# Altium project PCB_Project_IMX7.PrjPCB (part 2 of 9)

## Sheet IMX7S_CPU_INTERFACES_1.SchDoc
size A2
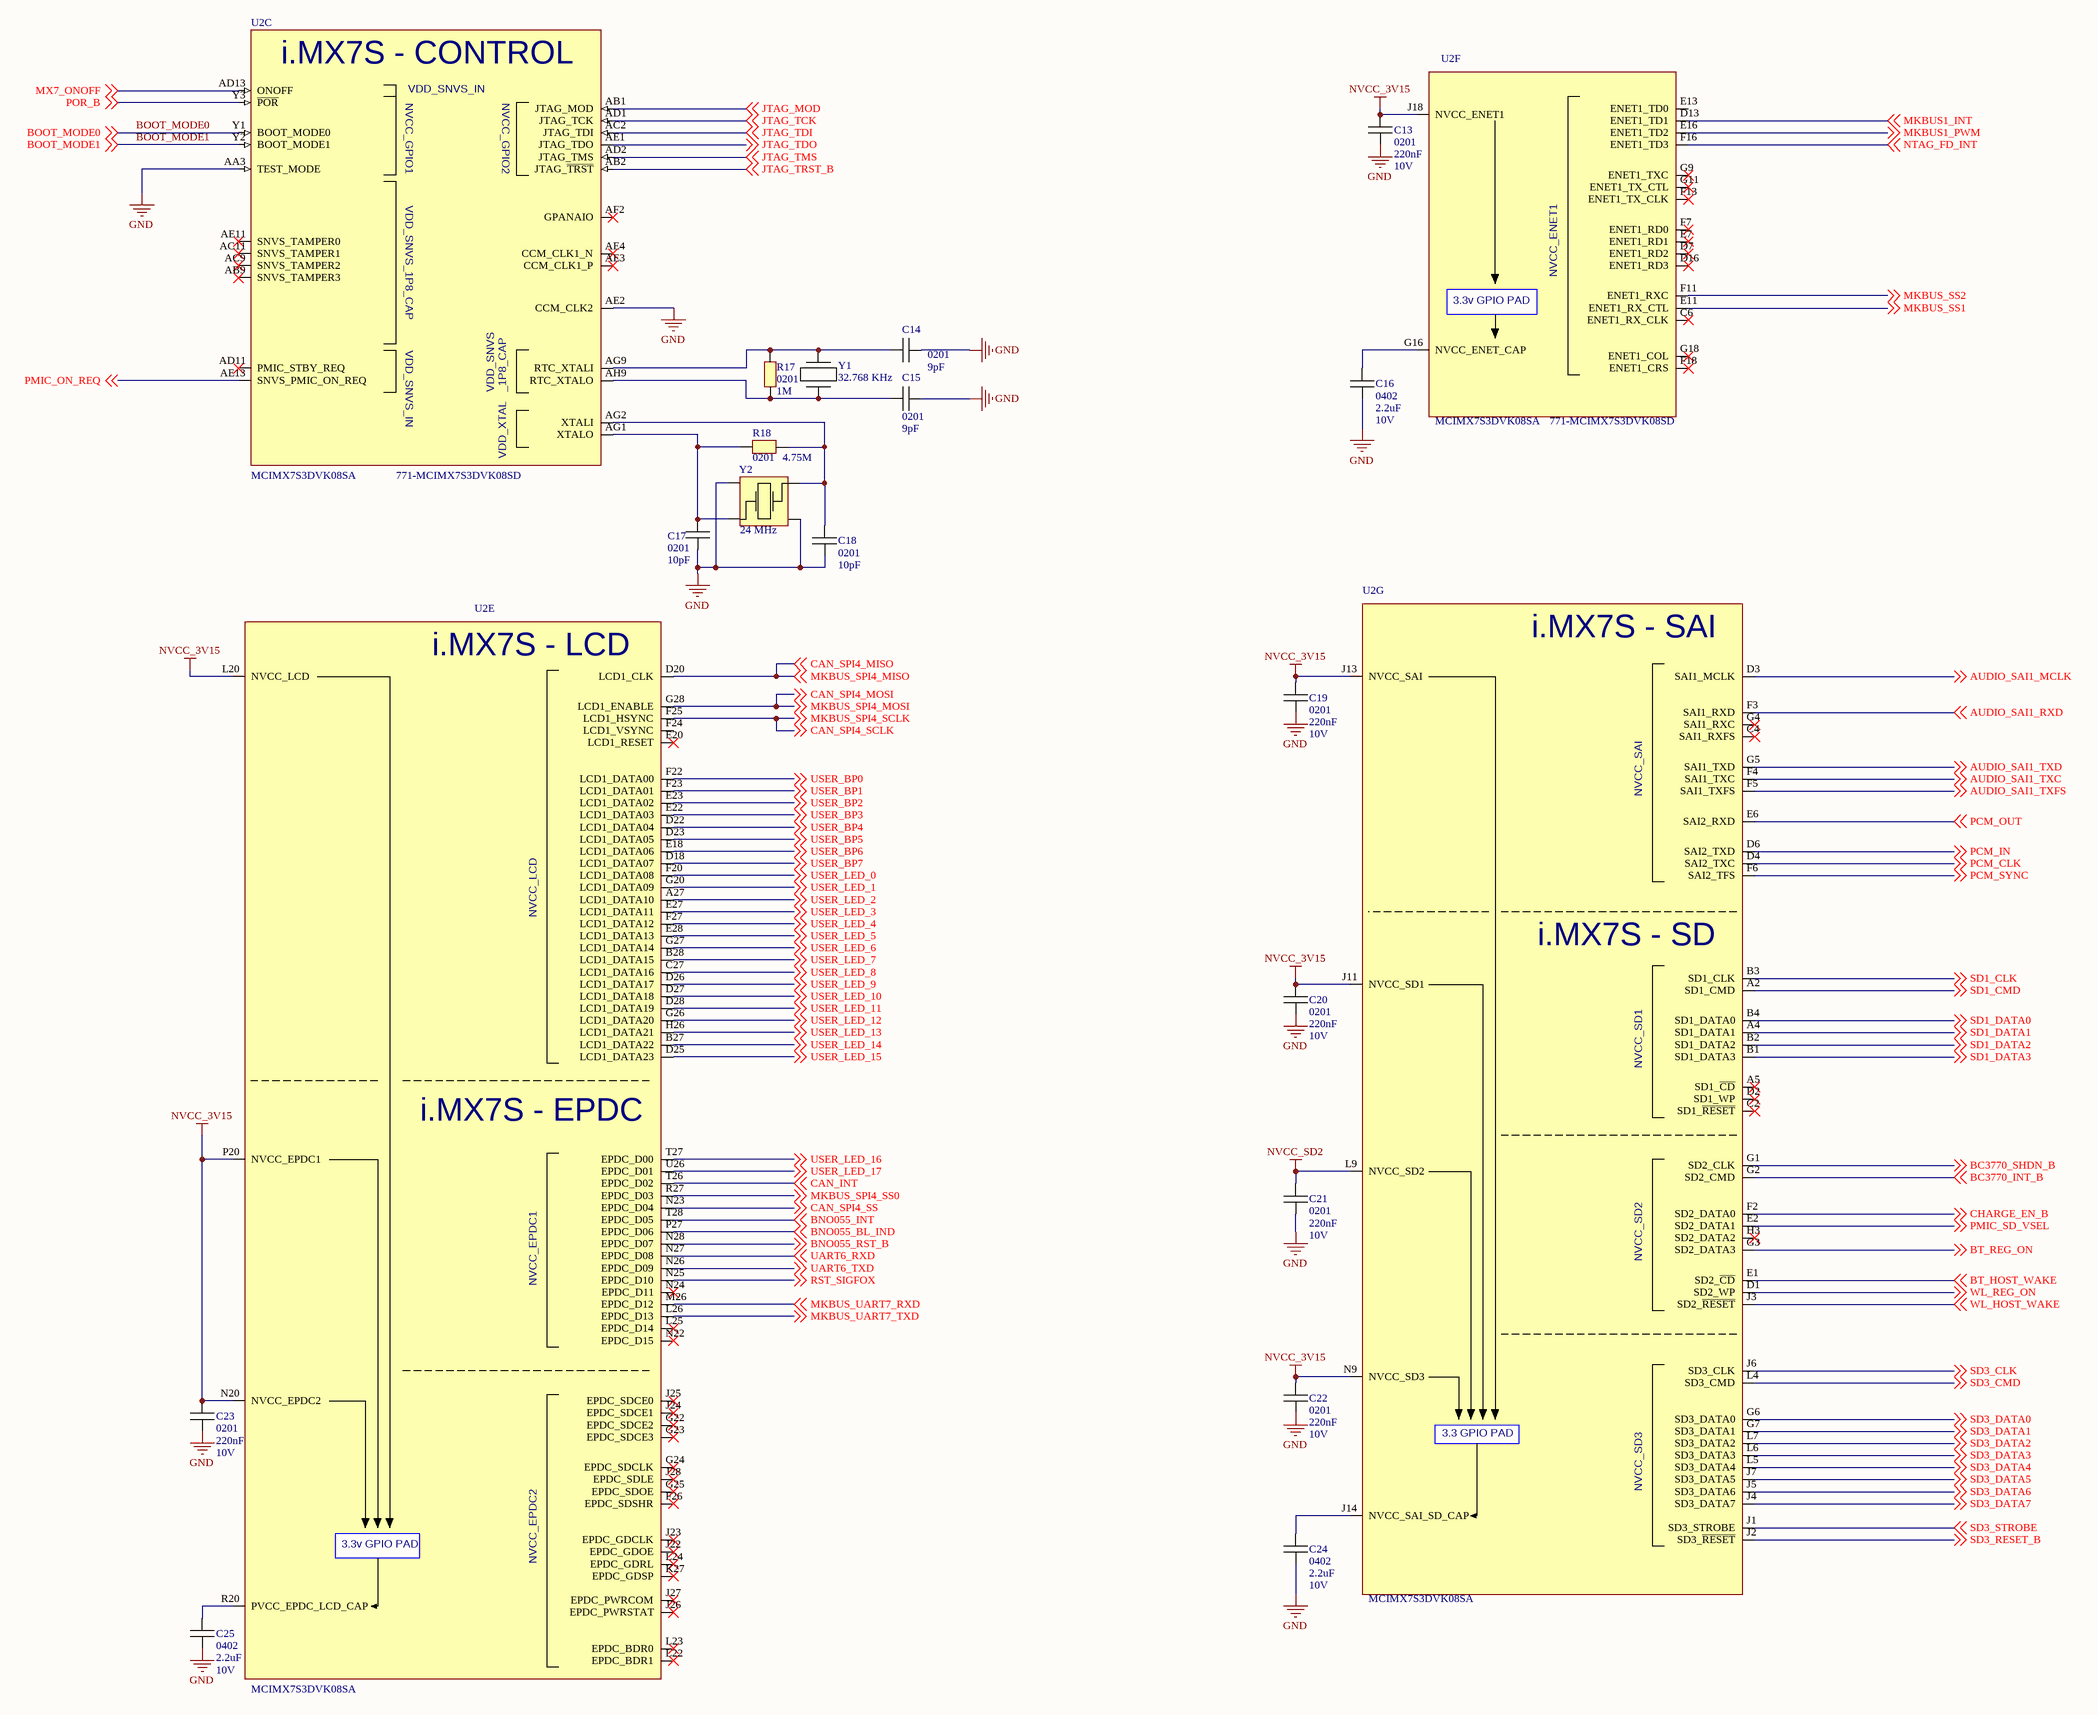
[diagram p2: IMX7S_CPU_INTERFACES_1.SchDoc]

### Parts
C13  value 220nF  PACKAGE: 0201  VOLTAGE: 10V  [C0201]  (hidden comment: C0201)
C14  value 9pF  PACKAGE: 0201  [C0201]  (hidden comment: C0201)
C15  value 9pF  PACKAGE: 0201  [C0201]  (hidden comment: C0201)
C16  value 2.2uF  PACKAGE: 0402  VOLTAGE: 10V  [C0402]  (hidden comment: C0402)
C17  value 10pF  PACKAGE: 0201  [C0201]  (hidden comment: C0201)
C18  value 10pF  PACKAGE: 0201  [C0201]  (hidden comment: C0201)
C19  value 220nF  PACKAGE: 0201  VOLTAGE: 10V  [C0201]  (hidden comment: C0201)
C20  value 220nF  PACKAGE: 0201  VOLTAGE: 10V  [C0201]  (hidden comment: C0201)
C21  value 220nF  PACKAGE: 0201  VOLTAGE: 10V  [C0201]  (hidden comment: C0201)
C22  value 220nF  PACKAGE: 0201  VOLTAGE: 10V  [C0201]  (hidden comment: C0201)
C23  value 220nF  PACKAGE: 0201  VOLTAGE: 10V  [C0201]  (hidden comment: C0201)
C24  value 2.2uF  PACKAGE: 0402  VOLTAGE: 10V  [C0402]  (hidden comment: C0402)
C25  value 2.2uF  PACKAGE: 0402  VOLTAGE: 10V  [C0402]  (hidden comment: C0402)
R17  value 1M  PACKAGE: 0201  [R0201]  (hidden comment: R0201)
R18  value 4.75M  PACKAGE: 0201  [R0201]  (hidden comment: R0201)
U2  MCIMX7S3DVK08SA  Supplier Part Number 1: 771-MCIMX7S3DVK08SD  [BGA 488 PIN]  (parts C,E,F,G of 13)
Y1  32.768 KHz  [ABS07]
Y2  24 MHz  [3225 Crystal]

### Nets
GND: C13.1 C14.1 C15.1 C16.1 C17.1 C18.1 C19.1 C20.1 C21.1 C22.1 C23.1 C24.1 C25.1 U2.AA3(TEST_MODE) U2.AE2(CCM_CLK2) Y2.1 Y2.3
NVCC_3V15: C13.2 C19.2 C20.2 C22.2 C23.2 U2.J11(NVCC_SD1) U2.J13(NVCC_SAI) U2.J18(NVCC_ENET1) U2.L20(NVCC_LCD) U2.N9(NVCC_SD3) U2.N20(NVCC_EPDC2) U2.P20(NVCC_EPDC1)
NVCC_SD2: C21.2 U2.L9(NVCC_SD2)
AUDIO_SAI1_MCLK: U2.D3(SAI1_MCLK) ; off-sheet AUDIO_SAI1_MCLK
AUDIO_SAI1_RXD: U2.F3(SAI1_RXD) ; off-sheet AUDIO_SAI1_RXD
AUDIO_SAI1_TXC: U2.F4(SAI1_TXC) ; off-sheet AUDIO_SAI1_TXC
AUDIO_SAI1_TXD: U2.G5(SAI1_TXD) ; off-sheet AUDIO_SAI1_TXD
AUDIO_SAI1_TXFS: U2.F5(SAI1_TXFS) ; off-sheet AUDIO_SAI1_TXFS
BC3770_INT_B: U2.G2(SD2_CMD) ; off-sheet BC3770_INT_B
BC3770_SHDN_B: U2.G1(SD2_CLK) ; off-sheet BC3770_SHDN_B
BNO055_BL_IND: U2.P27(EPDC_D06) ; off-sheet BNO055_BL_IND
BNO055_INT: U2.T28(EPDC_D05) ; off-sheet BNO055_INT
BNO055_RST_B: U2.N28(EPDC_D07) ; off-sheet BNO055_RST_B
BOOT_MODE0: U2.Y1(BOOT_MODE0) ; off-sheet BOOT_MODE0
BOOT_MODE1: U2.Y2(BOOT_MODE1) ; off-sheet BOOT_MODE1
BT_HOST_WAKE: U2.E1(SD2_~{CD}) ; off-sheet BT_HOST_WAKE
BT_REG_ON: U2.G3(SD2_DATA3) ; off-sheet BT_REG_ON
CAN_INT: U2.T26(EPDC_D02) ; off-sheet CAN_INT
CAN_SPI4_MISO: U2.D20(LCD1_CLK) ; off-sheet MKBUS_SPI4_MISO, off-sheet CAN_SPI4_MISO  [also labelled MKBUS_SPI4_MISO]
CAN_SPI4_MOSI: U2.G28(LCD1_ENABLE) ; off-sheet MKBUS_SPI4_MOSI, off-sheet CAN_SPI4_MOSI  [also labelled MKBUS_SPI4_MOSI]
CAN_SPI4_SCLK: U2.F25(LCD1_HSYNC) ; off-sheet MKBUS_SPI4_SCLK, off-sheet CAN_SPI4_SCLK  [also labelled MKBUS_SPI4_SCLK]
CAN_SPI4_SS: U2.N23(EPDC_D04) ; off-sheet CAN_SPI4_SS
CHARGE_EN_B: U2.F2(SD2_DATA0) ; off-sheet CHARGE_EN_B
JTAG_MOD: U2.AB1(JTAG_MOD) ; off-sheet JTAG_MOD
JTAG_TCK: U2.AD1(JTAG_TCK) ; off-sheet JTAG_TCK
JTAG_TDI: U2.AC2(JTAG_TDI) ; off-sheet JTAG_TDI
JTAG_TDO: U2.AE1(JTAG_TDO) ; off-sheet JTAG_TDO
JTAG_TMS: U2.AD2(JTAG_TMS) ; off-sheet JTAG_TMS
JTAG_TRST_B: U2.AB2(JTAG_~{TRST}) ; off-sheet JTAG_TRST_B
MKBUS1_INT: U2.D13(ENET1_TD1) ; off-sheet MKBUS1_INT
MKBUS1_PWM: U2.E16(ENET1_TD2) ; off-sheet MKBUS1_PWM
MKBUS_SPI4_SS0: U2.R27(EPDC_D03) ; off-sheet MKBUS_SPI4_SS0
MKBUS_SS1: U2.E11(ENET1_RX_CTL) ; off-sheet MKBUS_SS1
MKBUS_SS2: U2.F11(ENET1_RXC) ; off-sheet MKBUS_SS2
MKBUS_UART7_RXD: U2.M26(EPDC_D12) ; off-sheet MKBUS_UART7_RXD
MKBUS_UART7_TXD: U2.L26(EPDC_D13) ; off-sheet MKBUS_UART7_TXD
MX7_ONOFF: U2.AD13(ONOFF) ; off-sheet MX7_ONOFF
NTAG_FD_INT: U2.F16(ENET1_TD3) ; off-sheet NTAG_FD_INT
PCM_CLK: U2.D4(SAI2_TXC) ; off-sheet PCM_CLK
PCM_IN: U2.D6(SAI2_TXD) ; off-sheet PCM_IN
PCM_OUT: U2.E6(SAI2_RXD) ; off-sheet PCM_OUT
PCM_SYNC: U2.F6(SAI2_TFS) ; off-sheet PCM_SYNC
PMIC_ON_REQ: U2.AE13(SNVS_PMIC_ON_REQ) ; off-sheet PMIC_ON_REQ
PMIC_SD_VSEL: U2.E2(SD2_DATA1) ; off-sheet PMIC_SD_VSEL
POR_B: U2.Y3(~{POR}) ; off-sheet POR_B
RST_SIGFOX: U2.N25(EPDC_D10) ; off-sheet RST_SIGFOX
SD1_CLK: U2.B3(SD1_CLK) ; off-sheet SD1_CLK
SD1_CMD: U2.A2(SD1_CMD) ; off-sheet SD1_CMD
SD1_DATA0: U2.B4(SD1_DATA0) ; off-sheet SD1_DATA0
SD1_DATA1: U2.A4(SD1_DATA1) ; off-sheet SD1_DATA1
SD1_DATA2: U2.B2(SD1_DATA2) ; off-sheet SD1_DATA2
SD1_DATA3: U2.B1(SD1_DATA3) ; off-sheet SD1_DATA3
SD3_CLK: U2.J6(SD3_CLK) ; off-sheet SD3_CLK
SD3_CMD: U2.L4(SD3_CMD) ; off-sheet SD3_CMD
SD3_DATA0: U2.G6(SD3_DATA0) ; off-sheet SD3_DATA0
SD3_DATA1: U2.G7(SD3_DATA1) ; off-sheet SD3_DATA1
SD3_DATA2: U2.L7(SD3_DATA2) ; off-sheet SD3_DATA2
SD3_DATA3: U2.L6(SD3_DATA3) ; off-sheet SD3_DATA3
SD3_DATA4: U2.L5(SD3_DATA4) ; off-sheet SD3_DATA4
SD3_DATA5: U2.J7(SD3_DATA5) ; off-sheet SD3_DATA5
SD3_DATA6: U2.J5(SD3_DATA6) ; off-sheet SD3_DATA6
SD3_DATA7: U2.J4(SD3_DATA7) ; off-sheet SD3_DATA7
SD3_RESET_B: U2.J2(SD3_~{RESET}) ; off-sheet SD3_RESET_B
SD3_STROBE: U2.J1(SD3_STROBE) ; off-sheet SD3_STROBE
UART6_RXD: U2.N27(EPDC_D08) ; off-sheet UART6_RXD
UART6_TXD: U2.N26(EPDC_D09) ; off-sheet UART6_TXD
USER_BP0: U2.F22(LCD1_DATA00) ; off-sheet USER_BP0
USER_BP1: U2.F23(LCD1_DATA01) ; off-sheet USER_BP1
USER_BP2: U2.E23(LCD1_DATA02) ; off-sheet USER_BP2
USER_BP3: U2.E22(LCD1_DATA03) ; off-sheet USER_BP3
USER_BP4: U2.D22(LCD1_DATA04) ; off-sheet USER_BP4
USER_BP5: U2.D23(LCD1_DATA05) ; off-sheet USER_BP5
USER_BP6: U2.E18(LCD1_DATA06) ; off-sheet USER_BP6
USER_BP7: U2.D18(LCD1_DATA07) ; off-sheet USER_BP7
USER_LED_0: U2.F20(LCD1_DATA08) ; off-sheet USER_LED_0
USER_LED_1: U2.G20(LCD1_DATA09) ; off-sheet USER_LED_1
USER_LED_2: U2.A27(LCD1_DATA10) ; off-sheet USER_LED_2
USER_LED_3: U2.E27(LCD1_DATA11) ; off-sheet USER_LED_3
USER_LED_4: U2.F27(LCD1_DATA12) ; off-sheet USER_LED_4
USER_LED_5: U2.E28(LCD1_DATA13) ; off-sheet USER_LED_5
USER_LED_6: U2.G27(LCD1_DATA14) ; off-sheet USER_LED_6
USER_LED_7: U2.B28(LCD1_DATA15) ; off-sheet USER_LED_7
USER_LED_8: U2.C27(LCD1_DATA16) ; off-sheet USER_LED_8
USER_LED_9: U2.D26(LCD1_DATA17) ; off-sheet USER_LED_9
USER_LED_10: U2.D27(LCD1_DATA18) ; off-sheet USER_LED_10
USER_LED_11: U2.D28(LCD1_DATA19) ; off-sheet USER_LED_11
USER_LED_12: U2.G26(LCD1_DATA20) ; off-sheet USER_LED_12
USER_LED_13: U2.H26(LCD1_DATA21) ; off-sheet USER_LED_13
USER_LED_14: U2.B27(LCD1_DATA22) ; off-sheet USER_LED_14
USER_LED_15: U2.D25(LCD1_DATA23) ; off-sheet USER_LED_15
USER_LED_16: U2.T27(EPDC_D00) ; off-sheet USER_LED_16
USER_LED_17: U2.U26(EPDC_D01) ; off-sheet USER_LED_17
WL_HOST_WAKE: U2.J3(SD2_~{RESET}) ; off-sheet WL_HOST_WAKE
WL_REG_ON: U2.D1(SD2_WP) ; off-sheet WL_REG_ON
NetC14_2: C14.2 R17.2 U2.AG9(RTC_XTALI) Y1.2
NetC15_2: C15.2 R17.1 U2.AH9(RTC_XTALO) Y1.1
NetC16_2: C16.2 U2.G16(NVCC_ENET_CAP)
NetC17_2: C17.2 R18.2 U2.AG1(XTALO) Y2.2
NetC18_2: C18.2 R18.1 U2.AG2(XTALI) Y2.4
NetC24_2: C24.2 U2.J14(NVCC_SAI_SD_CAP)
NetC25_2: C25.2 U2.R20(PVCC_EPDC_LCD_CAP)

Not connected (* = marked no-connect by the designer): U2 A5(SD1_~{CD})* AB9(SNVS_TAMPER3)* AC9(SNVS_TAMPER2)* AC11(SNVS_TAMPER1)* AD11(PMIC_STBY_REQ)* AE3(CCM_CLK1_P)* AE4(CCM_CLK1_N)* AE11(SNVS_TAMPER0)* AF2(GPANAIO)* C2(SD1_~{RESET})* C4(SAI1_RXFS)* C6(ENET1_RX_CLK)* D2(SD1_WP)* D7(ENET1_RD2)* D16(ENET1_RD3)* E7(ENET1_RD1)* E13(ENET1_TD0) E20(LCD1_RESET)* F7(ENET1_RD0)* F13(ENET1_TX_CLK)* F18(ENET1_CRS)* F24(LCD1_VSYNC) F26(EPDC_SDSHR)* G4(SAI1_RXC)* G9(ENET1_TXC)* G11(ENET1_TX_CTL)* G18(ENET1_COL)* G22(EPDC_SDCE2)* G23(EPDC_SDCE3)* G24(EPDC_SDCLK)* G25(EPDC_SDOE)* H3(SD2_DATA2)* J22(EPDC_GDOE)* J23(EPDC_GDCLK)* J24(EPDC_SDCE1)* J25(EPDC_SDCE0)* J26(EPDC_PWRSTAT)* J27(EPDC_PWRCOM)* J28(EPDC_SDLE)* K27(EPDC_GDSP)* L22(EPDC_BDR1)* L23(EPDC_BDR0)* L24(EPDC_GDRL)* L25(EPDC_D14)* N22(EPDC_D15)* N24(EPDC_D11)*

### Notes on the sheet
- Title
- Size:
- Date:
- File:
- A2
- Number:
- Time:
- Revision:
- Sheet
- of
- (in symbol MCIMX7S3DVK08SD, part C) i.MX7S - CONTROL; VDD_SNVS; _1P8_CAP; VDD_XTAL
- (in symbol MCIMX7S3DVK08SD, part E) i.MX7S - LCD; i.MX7S - EPDC; 3.3v GPIO PAD
- (in symbol MCIMX7S3DVK08SD, part F) 3.3v GPIO PAD
- (in symbol MCIMX7S3DVK08SD, part G) i.MX7S - SAI; i.MX7S - SD; 3.3 GPIO PAD

### Library data of the parts
C13 C19-C23 = C0201: as C114 on sheet IMX7S_PMIC; Supplier 1: Farnell; Supplier Part Number 1: 2990687; Stock 1: 4290; Pricing 1: 10=0,04270, 100=0,02370, 500=0,01800, 2500=0,01350, 7500=0,00950, 15000=0,00760, 75000=0,00630 (EUR); RoHS: Yes; Mount: Surface Mount; Case/Package: 0201; Case Code (Metric): 0603; Case Code (Imperial): 0201; Min Operating Temperature: -55°C; Max Operating Temperature: 85°C; Capacitance: 220nF; Voltage Rating (DC): 10V; Packaging: Tape and Reel; Voltage Rating: 10V; Length: 0.024inch; Width: 0.012inch; Thickness: 0.013inch; ComponentLink1URL: http://www.mouser.com/ds/2/281/c02e-2905.pdf?src-supplier=Mouser; ComponentLink1Description: http://www.mouser.com/ds/2/281/c02e-2905.pdf?src-supplier=Mouser; ComponentLink2URL: http://search.murata.co.jp/Ceramy/image/img/A01X/G101/ENG/GRM033R61A224KE90-01.pdf?src-supplier=Digi-Key; ComponentLink2Description: http://search.murata.co.jp/Ceramy/image/img/A01X/G101/ENG/GRM033R61A224KE90-01.pdf?src-supplier=Digi-Key
C14 C15 = C0201: Manufacturer 1: TDK; Manufacturer Part Number 1: CGA1A2C0G1E090D030BA; VOLTAGE: 0V; Description: CAP CER 9PF 25V C0G 0201; Voltage Rating: 25V; Dielectric: C0G; Supplier 1: RSComponents; Supplier Part Number 1: 1447034; Stock 1: 15000; Pricing 1: 15000=0,00900 (EUR); RoHS: Yes; Mount: Surface Mount; Case/Package: 0201; Weight: 6E-06oz; Case Code (Metric): 0603; Case Code (Imperial): 0201; Min Operating Temperature: -55°C; Max Operating Temperature: 125°C; Package Quantity: 1; Packaging: Tape and Reel; Capacitance: 9pF; Voltage Rating (DC): 25V; Termination: SMD/SMT; Composition: Ceramic; Length: 0.024inch; Height: 0.3mm; Width: 0.012inch; Thickness: 0.012inch; Ratings: AEC-Q200; ComponentLink1URL: http://www.mouser.com/ds/2/400/lcc_automotive_general_en-843974.pdf?src-supplier=Mouser; ComponentLink1Description: http://www.mouser.com/ds/2/400/lcc_automotive_general_en-843974.pdf?src-supplier=Mouser; ComponentLink2URL: https://product.tdk.com/info/en/documents/chara_sheet/CGA1A2C0G1E090D030BA.pdf?src-supplier=Digi-Key; ComponentLink2Description: https://product.tdk.com/info/en/documents/chara_sheet/CGA1A2C0G1E090D030BA.pdf?src-supplier=Digi-Key; ComponentLink3URL: https://product.tdk.com/info/en/catalog/datasheets/mlcc_automotive_general_en.pdf?src-supplier=Digi-Key; ComponentLink3Description: https://product.tdk.com/info/en/catalog/datasheets/mlcc_automotive_general_en.pdf?src-supplier=Digi-Key; ComponentLink4URL: http://product.tdk.com/capacitor/mlcc/en/documents/mlcc_automotive_general_en.pdf?src-supplier=Avnet; ComponentLink4Description: http://product.tdk.com/capacitor/mlcc/en/documents/mlcc_automotive_general_en.pdf?src-supplier=Avnet
C16 C24 C25 = C0402: as C109 on sheet IMX7S_PMIC; Supplier 1: Farnell; Supplier Part Number 1: 2533930; Stock 1: 11802; Pricing 1: 10=0,21600, 100=0,14100, 500=0,10600, 2500=0,09320, 5000=0,07880, 10000=0,07420, 50000=0,06950 (EUR); RoHS: Yes; Mount: Surface Mount; Case/Package: 0402; Case Code (Metric): 1005; Case Code (Imperial): 0402; Min Operating Temperature: -55°C; Max Operating Temperature: 85°C; Packaging: Tape and Reel; Capacitance: 2.2uF; Voltage Rating: 10V; Length: 0.039inch; Width: 0.02inch; Thickness: 0.022inch; ComponentLink1URL: http://www.farnell.com/datasheets/2031748.pdf?src-supplier=Farnell; ComponentLink1Description: http://www.farnell.com/datasheets/2031748.pdf?src-supplier=Farnell; ComponentLink2URL: https://katalog.we-online.de/pbs/datasheet/885012105013.pdf?src-supplier=Digi-Key; ComponentLink2Description: https://katalog.we-online.de/pbs/datasheet/885012105013.pdf?src-supplier=Digi-Key
C17 C18 = C0201: Manufacturer 1: Murata; Manufacturer Part Number 1: GRM0335C1H180GA01D; VOLTAGE: 0V; Description: 0201 18 pF 50 V ±2% Tolerance C0G/NP0 Multilayer Ceramic Capacitor; Voltage Rating: 50V; Capacitance: 18pF; Tolerance: 2%; Supplier 1: Farnell; Supplier Part Number 1: 2990623; Stock 1: 11590; Pricing 1: 10=0,02610, 100=0,01320, 500=0,00970, 2500=0,00770, 7500=0,00570, 15000=0,00460, 75000=0,00310 (EUR); RoHS: Yes; Mount: Surface Mount; Case/Package: 0201; Case Code (Metric): 0603; Case Code (Imperial): 0201; Min Operating Temperature: -55°C; Max Operating Temperature: 125°C; Package Quantity: 15000; Packaging: Tape and Reel; Termination: SMD/SMT; Voltage Rating (DC): 50V; Length: 0.024inch; Width: 0.012inch; Thickness: 0.013inch; ComponentLink1URL: http://www.mouser.com/ds/2/281/c02e-2905.pdf?src-supplier=Mouser; ComponentLink1Description: http://www.mouser.com/ds/2/281/c02e-2905.pdf?src-supplier=Mouser; ComponentLink2URL: http://search.murata.co.jp/Ceramy/image/img/A01X/partnumbering_e_01.pdf?src-supplier=Digi-Key; ComponentLink2Description: http://search.murata.co.jp/Ceramy/image/img/A01X/partnumbering_e_01.pdf?src-supplier=Digi-Key; ComponentLink3URL: http://search.murata.co.jp/Ceramy/image/img/A01X/G101/ENG/GRM0335C1H180GA01-01.pdf?src-supplier=Digi-Key; ComponentLink3Description: http://search.murata.co.jp/Ceramy/image/img/A01X/G101/ENG/GRM0335C1H180GA01-01.pdf?src-supplier=Digi-Key
R17 = R0201: Manufacturer 1: Multicomp; Manufacturer Part Number 1: MCRE000212; VOLTAGE: 0V; Description: MULTICOMP   MCRE000212   Surface Mount Chip Resistor, Thick Film, MCRE Series, 1 Mohm, 50 mW,  1%, 25 V, 0201 [0603 Metric]; Resistance: 1MR; Power Rating: 50mW; Tolerance: 1%; Voltage Rating: 25V; Temperature Coefficient: 200ppm/°C; Supplier 1: Farnell; Supplier Part Number 1: 1711695; Stock 1: 21808; Pricing 1: 10=0,01700, 100=0,01020, 500=0,00730, 2500=0,00570, 7500=0,00460 (EUR); RoHS: Yes; Case/Package: SMD/SMT; Case Code (Metric): 0603; Case Code (Imperial): 0201; Min Operating Temperature: -55°C; Max Operating Temperature: 125°C; Packaging: Cut Tape; Composition: Thick Film; Voltage Rating (DC): 25V; Width: 0.6mm; REACH SVHC: No SVHC; ComponentLink1URL: https://datasheet.ciiva.com/7919/1729044-7919021.pdf?src-supplier=Element14; ComponentLink1Description: https://datasheet.ciiva.com/7919/1729044-7919021.pdf?src-supplier=Element14; ComponentLink2URL: https://datasheet.ciiva.com/7919/1729044-7919022.pdf?src-supplier=Element14; ComponentLink2Description: https://datasheet.ciiva.com/7919/1729044-7919022.pdf?src-supplier=Element14; ComponentLink3URL: https://datasheet.ciiva.com/22689/1729044-22689531.pdf?src-supplier=Element14; ComponentLink3Description: https://datasheet.ciiva.com/22689/1729044-22689531.pdf?src-supplier=Element14
R18 = R0201: Manufacturer 1: Multicomp; Manufacturer Part Number 1: MC0201L6J4704SE; VOLTAGE: 0V; Description: MULTICOMP - MC0201L6J4704SE - RES, 4M7, 5%, 0.05W, 0201, THICK FILM; Resistance: 4.7MR; Tolerance: 5%; Temperature Coefficient: 200ppm/°C; Power Rating: 50mW; Voltage Rating: 25V; Supplier 1: Farnell; Supplier Part Number 1: 1851499; Stock 1: 16622; Pricing 1: 10=0,00930, 100=0,00720, 500=0,00640, 2500=0,00440, 5000=0,00380, 10000=0,00330, 50000=0,00240, 100000=0,00230 (EUR); RoHS: Yes; Case/Package: 0201; Number of Pins: 2; Case Code (Metric): 0603; Case Code (Imperial): 0201; Packaging: Cut Tape; Composition: Thick Film; Voltage Rating (DC): 25V; REACH SVHC: Unknown; ComponentLink1URL: http://www.farnell.com/datasheets/1719193.pdf?src-supplier=Farnell; ComponentLink1Description: http://www.farnell.com/datasheets/1719193.pdf?src-supplier=Farnell; ComponentLink2URL: http://www.farnell.com/datasheets/1719193.pdf?src-supplier=Element14; ComponentLink2Description: http://www.farnell.com/datasheets/1719193.pdf?src-supplier=Element14
U2 = MCIMX7S3DVK08SD: Supplier 1: Mouser
Y1 = Quartz 32.768: Supplier 1: Farnell; Supplier Part Number 1: 2819305
Y2 = Quartz 24M: Supplier 1: Farnell; Supplier Part Number 1: 2853961

## Sheet IMX7S_CPU_INTERFACES_2.SchDoc
size A2
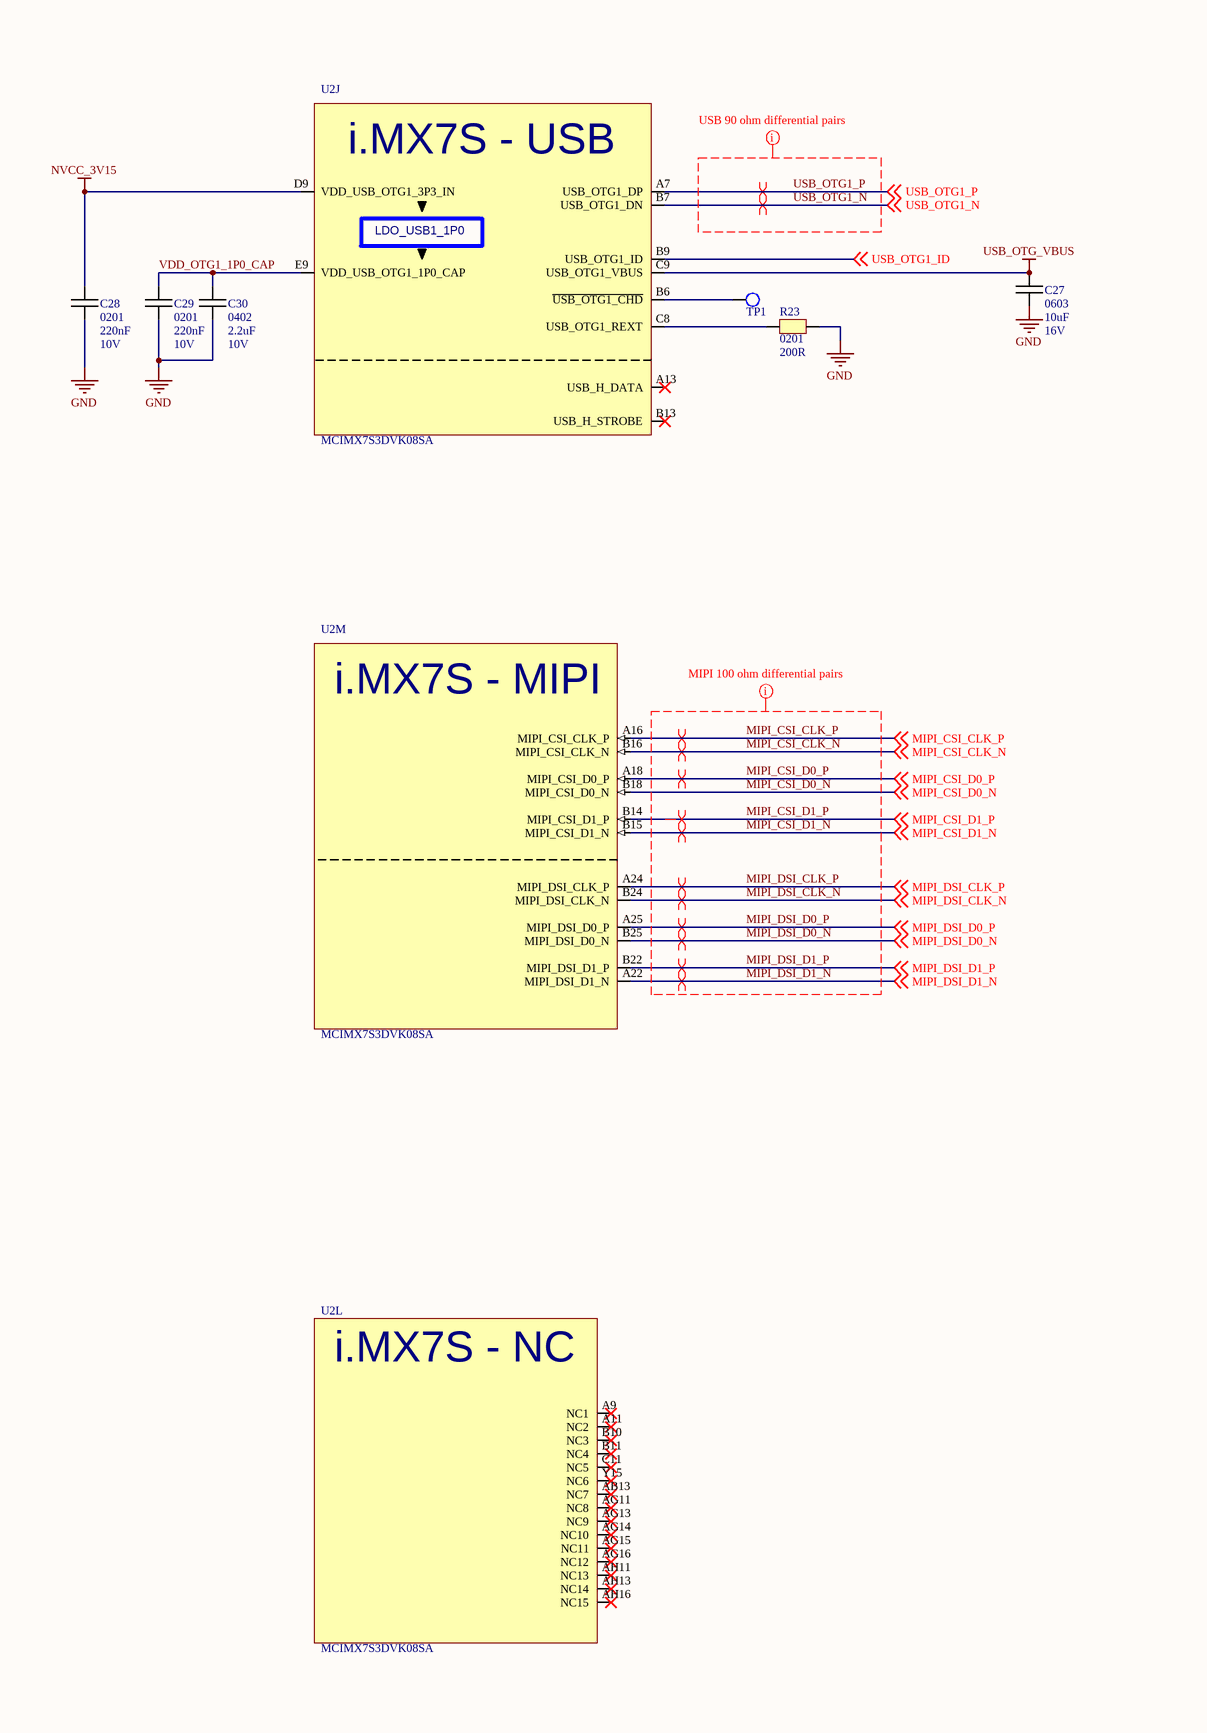
[diagram p3: IMX7S_CPU_INTERFACES_2.SchDoc, left]
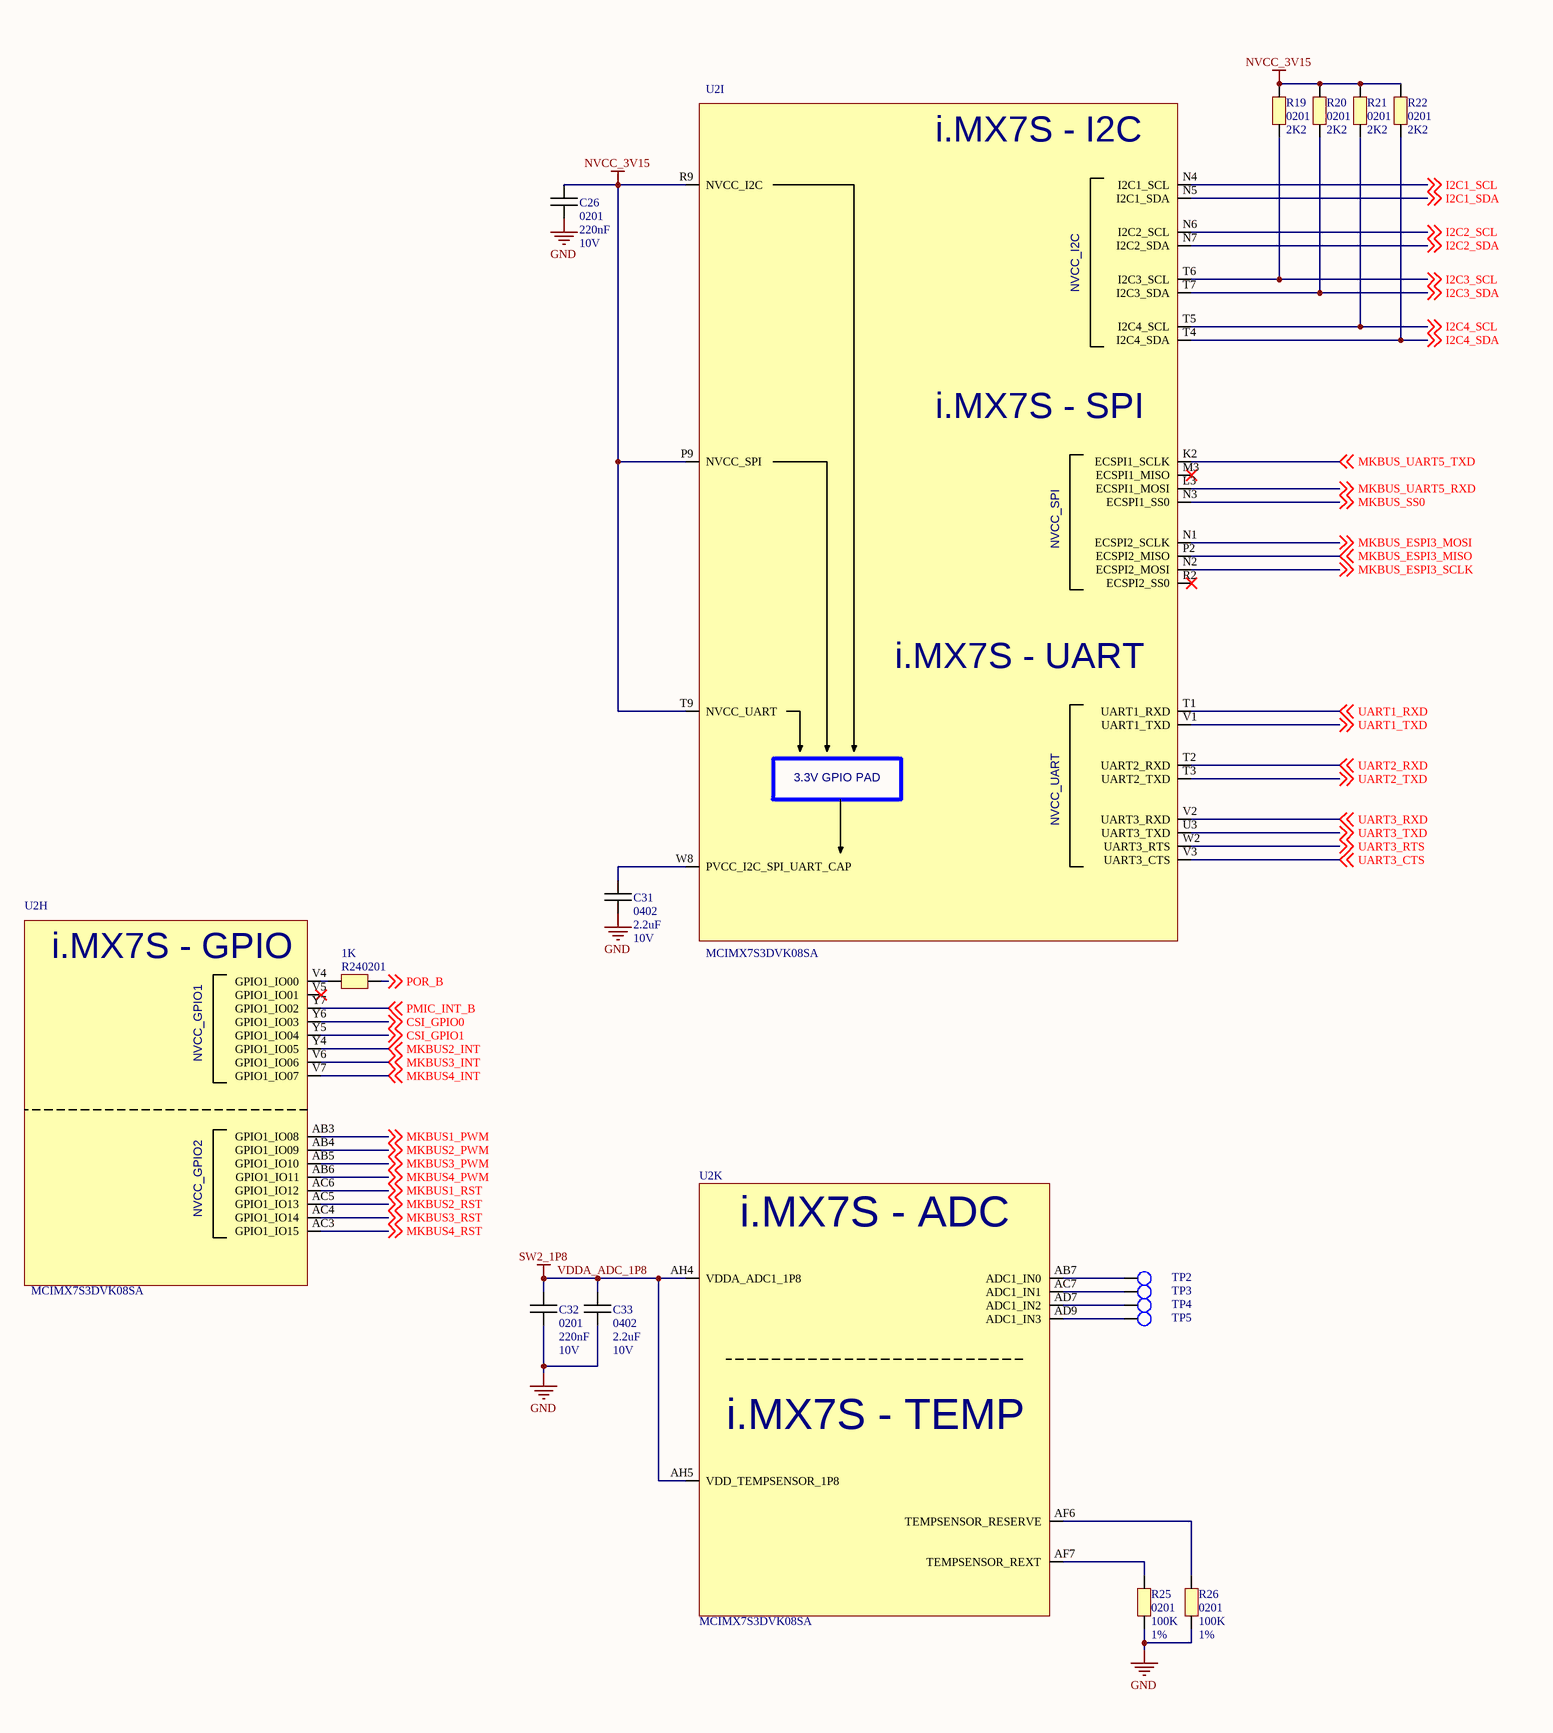
[diagram p4: IMX7S_CPU_INTERFACES_2.SchDoc, right]

### Parts
C26  value 220nF  PACKAGE: 0201  VOLTAGE: 10V  [C0201]  (hidden comment: C0201)
C27  value 10uF  PACKAGE: 0603  VOLTAGE: 16V  [C0603]  (hidden comment: C0603)
C28  value 220nF  PACKAGE: 0201  VOLTAGE: 10V  [C0201]  (hidden comment: C0201)
C29  value 220nF  PACKAGE: 0201  VOLTAGE: 10V  [C0201]  (hidden comment: C0201)
C30  value 2.2uF  PACKAGE: 0402  VOLTAGE: 10V  [C0402]  (hidden comment: C0402)
C31  value 2.2uF  PACKAGE: 0402  VOLTAGE: 10V  [C0402]  (hidden comment: C0402)
C32  value 220nF  PACKAGE: 0201  VOLTAGE: 10V  [C0201]  (hidden comment: C0201)
C33  value 2.2uF  PACKAGE: 0402  VOLTAGE: 10V  [C0402]  (hidden comment: C0402)
R19  value 2K2  PACKAGE: 0201  [R0201]  (hidden comment: R0201)
R20  value 2K2  PACKAGE: 0201  [R0201]  (hidden comment: R0201)
R21  value 2K2  PACKAGE: 0201  [R0201]  (hidden comment: R0201)
R22  value 2K2  PACKAGE: 0201  [R0201]  (hidden comment: R0201)
R23  value 200R  PACKAGE: 0201  [R0201]  (hidden comment: R0201)
R24  value 1K  PACKAGE: 0201  [R0201]  (hidden comment: R0201)
R25  value 100K  PACKAGE: 0201  VOLTAGE: 1%  [R0201]  (hidden comment: R0201)
R26  value 100K  PACKAGE: 0201  VOLTAGE: 1%  [R0201]  (hidden comment: R0201)
TP1  TestPoint  [TESTPOINT]  (value not drawn)
TP2  TestPoint  [TESTPOINT]  (value not drawn)
TP3  TestPoint  [TESTPOINT]  (value not drawn)
TP4  TestPoint  [TESTPOINT]  (value not drawn)
TP5  TestPoint  [TESTPOINT]  (value not drawn)
U2  MCIMX7S3DVK08SA  [BGA 488 PIN]  (parts H,I,J,K,L,M of 13)

### Nets
GND: C26.1 C27.1 C28.1 C29.1 C30.1 C31.1 C32.1 C33.1 R23.2 R25.1 R26.1
NVCC_3V15: C26.2 C28.2 R19.2 R20.2 R21.2 R22.2 U2.D9(VDD_USB_OTG1_3P3_IN) U2.P9(NVCC_SPI) U2.R9(NVCC_I2C) U2.T9(NVCC_UART)
USB_OTG_VBUS: C27.2 U2.C9(USB_OTG1_VBUS)
VDDA_ADC_1P8: C32.2 C33.2 U2.AH4(VDDA_ADC1_1P8) U2.AH5(VDD_TEMPSENSOR_1P8)  [also labelled SW2_1P8]
CSI_GPIO0: U2.Y6(GPIO1_IO03) ; off-sheet CSI_GPIO0
CSI_GPIO1: U2.Y5(GPIO1_IO04) ; off-sheet CSI_GPIO1
I2C1_SCL: U2.N4(I2C1_SCL) ; off-sheet I2C1_SCL
I2C1_SDA: U2.N5(I2C1_SDA) ; off-sheet I2C1_SDA
I2C2_SCL: U2.N6(I2C2_SCL) ; off-sheet I2C2_SCL
I2C2_SDA: U2.N7(I2C2_SDA) ; off-sheet I2C2_SDA
I2C3_SCL: R19.1 U2.T6(I2C3_SCL) ; off-sheet I2C3_SCL
I2C3_SDA: R20.1 U2.T7(I2C3_SDA) ; off-sheet I2C3_SDA
I2C4_SCL: R21.1 U2.T5(I2C4_SCL) ; off-sheet I2C4_SCL
I2C4_SDA: R22.1 U2.T4(I2C4_SDA) ; off-sheet I2C4_SDA
MIPI_CSI_CLK_N: U2.B16(MIPI_CSI_CLK_N) ; off-sheet MIPI_CSI_CLK_N  [project net CSI_CLK_N]
MIPI_CSI_CLK_P: U2.A16(MIPI_CSI_CLK_P) ; off-sheet MIPI_CSI_CLK_P  [project net CSI_CLK_P]
MIPI_CSI_D0_N: U2.B18(MIPI_CSI_D0_N) ; off-sheet MIPI_CSI_D0_N  [project net CSI_D0_N]
MIPI_CSI_D0_P: U2.A18(MIPI_CSI_D0_P) ; off-sheet MIPI_CSI_D0_P  [project net CSI_D0_P]
MIPI_CSI_D1_N: U2.B15(MIPI_CSI_D1_N) ; off-sheet MIPI_CSI_D1_N  [project net CSI_D1_N]
MIPI_CSI_D1_P: U2.B14(MIPI_CSI_D1_P) ; off-sheet MIPI_CSI_D1_P  [project net CSI_D1_P]
MIPI_DSI_CLK_N: U2.B24(MIPI_DSI_CLK_N) ; off-sheet MIPI_DSI_CLK_N  [project net DSI_CLK_N]
MIPI_DSI_CLK_P: U2.A24(MIPI_DSI_CLK_P) ; off-sheet MIPI_DSI_CLK_P  [project net DSI_CLK_P]
MIPI_DSI_D0_N: U2.B25(MIPI_DSI_D0_N) ; off-sheet MIPI_DSI_D0_N  [project net DSI_D0_N]
MIPI_DSI_D0_P: U2.A25(MIPI_DSI_D0_P) ; off-sheet MIPI_DSI_D0_P  [project net DSI_D0_P]
MIPI_DSI_D1_N: U2.A22(MIPI_DSI_D1_N) ; off-sheet MIPI_DSI_D1_N  [project net DSI_D1_N]
MIPI_DSI_D1_P: U2.B22(MIPI_DSI_D1_P) ; off-sheet MIPI_DSI_D1_P  [project net DSI_D1_P]
MKBUS1_PWM: U2.AB3(GPIO1_IO08) ; off-sheet MKBUS1_PWM
MKBUS1_RST: U2.AC6(GPIO1_IO12) ; off-sheet MKBUS1_RST
MKBUS2_INT: U2.Y4(GPIO1_IO05) ; off-sheet MKBUS2_INT
MKBUS2_PWM: U2.AB4(GPIO1_IO09) ; off-sheet MKBUS2_PWM
MKBUS2_RST: U2.AC5(GPIO1_IO13) ; off-sheet MKBUS2_RST
MKBUS3_INT: U2.V6(GPIO1_IO06) ; off-sheet MKBUS3_INT
MKBUS3_PWM: U2.AB5(GPIO1_IO10) ; off-sheet MKBUS3_PWM
MKBUS3_RST: U2.AC4(GPIO1_IO14) ; off-sheet MKBUS3_RST
MKBUS4_INT: U2.V7(GPIO1_IO07) ; off-sheet MKBUS4_INT
MKBUS4_PWM: U2.AB6(GPIO1_IO11) ; off-sheet MKBUS4_PWM
MKBUS4_RST: U2.AC3(GPIO1_IO15) ; off-sheet MKBUS4_RST
MKBUS_ESPI3_MISO: U2.P2(ECSPI2_MISO) ; off-sheet MKBUS_ESPI3_MISO
MKBUS_ESPI3_MOSI: U2.N1(ECSPI2_SCLK) ; off-sheet MKBUS_ESPI3_MOSI
MKBUS_ESPI3_SCLK: U2.N2(ECSPI2_MOSI) ; off-sheet MKBUS_ESPI3_SCLK
MKBUS_SS0: U2.N3(ECSPI1_SS0) ; off-sheet MKBUS_SS0
MKBUS_UART5_RXD: U2.L3(ECSPI1_MOSI) ; off-sheet MKBUS_UART5_RXD
MKBUS_UART5_TXD: U2.K2(ECSPI1_SCLK) ; off-sheet MKBUS_UART5_TXD
PMIC_INT_B: U2.Y7(GPIO1_IO02) ; off-sheet PMIC_INT_B
POR_B: R24.1 ; off-sheet POR_B
UART1_RXD: U2.T1(UART1_RXD) ; off-sheet UART1_RXD
UART1_TXD: U2.V1(UART1_TXD) ; off-sheet UART1_TXD
UART2_RXD: U2.T2(UART2_RXD) ; off-sheet UART2_RXD
UART2_TXD: U2.T3(UART2_TXD) ; off-sheet UART2_TXD
UART3_CTS: U2.V3(UART3_CTS) ; off-sheet UART3_CTS
UART3_RTS: U2.W2(UART3_RTS) ; off-sheet UART3_RTS
UART3_RXD: U2.V2(UART3_RXD) ; off-sheet UART3_RXD
UART3_TXD: U2.U3(UART3_TXD) ; off-sheet UART3_TXD
USB_OTG1_ID: U2.B9(USB_OTG1_ID) ; off-sheet USB_OTG1_ID  [project net USB_OTG_ID]
USB_OTG1_N: U2.B7(USB_OTG1_DN) ; off-sheet USB_OTG1_N
USB_OTG1_P: U2.A7(USB_OTG1_DP) ; off-sheet USB_OTG1_P
VDD_OTG1_1P0_CAP: C29.2 C30.2 U2.E9(VDD_USB_OTG1_1P0_CAP)
NetC31_2: C31.2 U2.W8(PVCC_I2C_SPI_UART_CAP)
NetR23_1: R23.1 U2.C8(USB_OTG1_REXT)
NetR24_2: R24.2 U2.V4(GPIO1_IO00)
NetR25_2: R25.2 U2.AF7(TEMPSENSOR_REXT)
NetR26_2: R26.2 U2.AF6(TEMPSENSOR_RESERVE)
NetTP1_1: TP1.1 U2.B6(~{USB_OTG1_CHD})
NetTP2_1: TP2.1 U2.AB7(ADC1_IN0)
NetTP3_1: TP3.1 U2.AC7(ADC1_IN1)
NetTP4_1: TP4.1 U2.AD7(ADC1_IN2)
NetTP5_1: TP5.1 U2.AD9(ADC1_IN3)

Not connected (* = marked no-connect by the designer): U2 A9(NC1)* A11(NC2)* A13(USB_H_DATA)* AB13(NC7)* AG11(NC8)* AG13(NC9)* AG14(NC10)* AG15(NC11)* AG16(NC12)* AH11(NC13)* AH13(NC14)* AH16(NC15)* B10(NC3)* B11(NC4)* B13(USB_H_STROBE)* C11(NC5)* M3(ECSPI1_MISO)* R2(ECSPI2_SS0)* V5(GPIO1_IO01)* Y15(NC6)*

### Layout directives
differential pair: CSI_CLK_N, CSI_CLK_P, CSI_D0_P, CSI_D1_N, CSI_D1_P, DSI_CLK_N, DSI_CLK_P, DSI_D0_N, DSI_D0_P, DSI_D1_N, DSI_D1_P, USB_OTG1_N, USB_OTG1_P
mark named USB 90 ohm differential pairs: USB_OTG1_N, USB_OTG1_P
mark named MIPI 100 ohm differential pairs: MIPI_CSI_CLK_N, MIPI_CSI_CLK_P, MIPI_CSI_D0_N, MIPI_CSI_D0_P, MIPI_CSI_D1_N, MIPI_CSI_D1_P, MIPI_DSI_CLK_N, MIPI_DSI_CLK_P, MIPI_DSI_D0_N, MIPI_DSI_D0_P, MIPI_DSI_D1_N, MIPI_DSI_D1_P

### Notes on the sheet
- Title
- Size:
- Date:
- File:
- A2
- Number:
- Time:
- Revision:
- Sheet
- of
- (in symbol MCIMX7S3DVK08SD, part H) i.MX7S - GPIO
- (in symbol MCIMX7S3DVK08SD, part I) i.MX7S - I2C; i.MX7S - SPI; i.MX7S - UART; 3.3V GPIO PAD
- (in symbol MCIMX7S3DVK08SD, part J) i.MX7S - USB; LDO_USB1_1P0
- (in symbol MCIMX7S3DVK08SD, part K) i.MX7S - ADC; i.MX7S - TEMP
- (in symbol MCIMX7S3DVK08SD, part L) i.MX7S - NC
- (in symbol MCIMX7S3DVK08SD, part M) i.MX7S - MIPI

### Library data of the parts
C26 C28 C29 C32 = C0201: as C114 on sheet IMX7S_PMIC; Supplier 1: Farnell; Supplier Part Number 1: 2990687; Stock 1: 4290; Pricing 1: 10=0,04270, 100=0,02370, 500=0,01800, 2500=0,01350, 7500=0,00950, 15000=0,00760, 75000=0,00630 (EUR); RoHS: Yes; Mount: Surface Mount; Case/Package: 0201; Case Code (Metric): 0603; Case Code (Imperial): 0201; Min Operating Temperature: -55°C; Max Operating Temperature: 85°C; Capacitance: 220nF; Voltage Rating (DC): 10V; Packaging: Tape and Reel; Voltage Rating: 10V; Length: 0.024inch; Width: 0.012inch; Thickness: 0.013inch; ComponentLink1URL: http://www.mouser.com/ds/2/281/c02e-2905.pdf?src-supplier=Mouser; ComponentLink1Description: http://www.mouser.com/ds/2/281/c02e-2905.pdf?src-supplier=Mouser; ComponentLink2URL: http://search.murata.co.jp/Ceramy/image/img/A01X/G101/ENG/GRM033R61A224KE90-01.pdf?src-supplier=Digi-Key; ComponentLink2Description: http://search.murata.co.jp/Ceramy/image/img/A01X/G101/ENG/GRM033R61A224KE90-01.pdf?src-supplier=Digi-Key
C27 = C0603: Manufacturer 1: Murata; Manufacturer Part Number 1: GRM188R61A106KE69D; Description: Cap Ceramic 10uF 10V X5R 10% SMD 0603 85C Paper T/R; Tolerance: 10%; Dielectric: X5R; Voltage Rating: 10V; Supplier 1: Farnell; Supplier Part Number 1: 2666494; Stock 1: 472000; Pricing 1: 4000=0,02960, 20000=0,02600 (EUR); RoHS: Yes; Mount: Surface Mount; Case/Package: 0603; Case Code (Metric): 1608; Case Code (Imperial): 0603; Min Operating Temperature: -55°C; Max Operating Temperature: 85°C; Capacitance: 10uF; Packaging: Tape and Reel; Voltage Rating (DC): 10V; Length: 1.6mm; Height: 0.8mm; Width: 0.031inch; Thickness: 0.037inch; Depth: 0.8mm; REACH SVHC: No SVHC; Lead Free: Lead Free; ComponentLink1URL: http://components.arrow.com/part/dataview/0323_07281717?src-supplier=Arrow+Europe; ComponentLink1Description: http://components.arrow.com/part/dataview/0323_07281717?src-supplier=Arrow+Europe; ComponentLink2URL: http://www.farnell.com/datasheets/1955682.pdf?src-supplier=Farnell; ComponentLink2Description: http://www.farnell.com/datasheets/1955682.pdf?src-supplier=Farnell; ComponentLink3URL: http://www.mouser.com/ds/2/281/c02e-2905.pdf?src-supplier=Mouser; ComponentLink3Description: http://www.mouser.com/ds/2/281/c02e-2905.pdf?src-supplier=Mouser; ComponentLink4URL: http://search.murata.co.jp/Ceramy/image/img/A01X/G101/ENG/GRM188R61A106KE69-01.pdf?src-supplier=Digi-Key; ComponentLink4Description: http://search.murata.co.jp/Ceramy/image/img/A01X/G101/ENG/GRM188R61A106KE69-01.pdf?src-supplier=Digi-Key; ComponentLink5URL: http://www.farnell.com/datasheets/1955682.pdf?src-supplier=Newark; ComponentLink5Description: http://www.farnell.com/datasheets/1955682.pdf?src-supplier=Newark; ComponentLink6URL: http://www.farnell.com/datasheets/1955682.pdf?src-supplier=Element14; ComponentLink6Description: http://www.farnell.com/datasheets/1955682.pdf?src-supplier=Element14; ComponentLink7URL: http://psearch.en.murata.com/capacitor/product/GRM188R61A106KE69%23.pdf?src-supplier=Avnet; ComponentLink7Description: http://psearch.en.murata.com/capacitor/product/GRM188R61A106KE69%23.pdf?src-supplier=Avnet
C30 = C0402: Manufacturer 1: Murata; Manufacturer Part Number 1: GRM155R61A225KE95D; Description: Cap Ceramic 2.2uF 10V X5R 10% SMD 0402 85C Paper T/R; Material: Ceramic; Tolerance: 10%; Dielectric: X5R; Supplier 1: Farnell; Supplier Part Number 1: 2666415; Stock 1: 170000; Pricing 1: 10000=0,01960, 50000=0,01630 (EUR); RoHS: Yes; Mount: Surface Mount; Case/Package: 0402; Weight: 0.000212oz; Case Code (Metric): 1005; Case Code (Imperial): 0402; Min Operating Temperature: -55°C; Max Operating Temperature: 85°C; Capacitance: 2.2uF; Voltage Rating: 10V; Packaging: Tape and Reel; Termination: SMD/SMT; Voltage Rating (DC): 10V; Package Quantity: 10000; Length: 1mm; Height: 0.5mm; Width: 0.5mm; Thickness: 0.022inch; Depth: 0.5mm; REACH SVHC: No SVHC; Lead Free: Lead Free; ComponentLink1URL: http://www.mouser.com/ds/2/281/c02e-2905.pdf?src-supplier=Mouser; ComponentLink1Description: http://www.mouser.com/ds/2/281/c02e-2905.pdf?src-supplier=Mouser; ComponentLink2URL: http://components.arrow.com/part/dataview/0323_04264073?src-supplier=Arrow+Europe; ComponentLink2Description: http://components.arrow.com/part/dataview/0323_04264073?src-supplier=Arrow+Europe; ComponentLink3URL: http://www.farnell.com/datasheets/1872202.pdf?src-supplier=Farnell; ComponentLink3Description: http://www.farnell.com/datasheets/1872202.pdf?src-supplier=Farnell; ComponentLink4URL: http://www.farnell.com/datasheets/2047915.pdf?src-supplier=Farnell; ComponentLink4Description: http://www.farnell.com/datasheets/2047915.pdf?src-supplier=Farnell; ComponentLink5URL: http://www.farnell.com/datasheets/2047915.pdf?src-supplier=Element14; ComponentLink5Description: http://www.farnell.com/datasheets/2047915.pdf?src-supplier=Element14; ComponentLink6URL: http://psearch.en.murata.com/capacitor/product/GRM155R61A225KE95%23.pdf?src-supplier=Avnet; ComponentLink6Description: http://psearch.en.murata.com/capacitor/product/GRM155R61A225KE95%23.pdf?src-supplier=Avnet; ComponentLink7URL: https://search.murata.co.jp/Ceramy/image/img/A01X/G101/ENG/GRM155R61A225KE95-01.pdf?src-supplier=Digi-Key; ComponentLink7Description: https://search.murata.co.jp/Ceramy/image/img/A01X/G101/ENG/GRM155R61A225KE95-01.pdf?src-supplier=Digi-Key; ComponentLink8URL: http://search.murata.co.jp/Ceramy/image/img/A01X/G101/ENG/GRM155R61A225KE95-01.pdf?src-supplier=Digi-Key; ComponentLink8Description: http://search.murata.co.jp/Ceramy/image/img/A01X/G101/ENG/GRM155R61A225KE95-01.pdf?src-supplier=Digi-Key
C31 C33 = C0402: as C109 on sheet IMX7S_PMIC; Supplier 1: Farnell; Supplier Part Number 1: 2533930; Stock 1: 11802; Pricing 1: 10=0,21600, 100=0,14100, 500=0,10600, 2500=0,09320, 5000=0,07880, 10000=0,07420, 50000=0,06950 (EUR); RoHS: Yes; Mount: Surface Mount; Case/Package: 0402; Case Code (Metric): 1005; Case Code (Imperial): 0402; Min Operating Temperature: -55°C; Max Operating Temperature: 85°C; Packaging: Tape and Reel; Capacitance: 2.2uF; Voltage Rating: 10V; Length: 0.039inch; Width: 0.02inch; Thickness: 0.022inch; ComponentLink1URL: http://www.farnell.com/datasheets/2031748.pdf?src-supplier=Farnell; ComponentLink1Description: http://www.farnell.com/datasheets/2031748.pdf?src-supplier=Farnell; ComponentLink2URL: https://katalog.we-online.de/pbs/datasheet/885012105013.pdf?src-supplier=Digi-Key; ComponentLink2Description: https://katalog.we-online.de/pbs/datasheet/885012105013.pdf?src-supplier=Digi-Key
R19-R22 = R0201: Manufacturer 1: Multicomp; Manufacturer Part Number 1: MCRE000148; VOLTAGE: 0V; Description: MULTICOMP - MCRE000148 - RES, 2K2, 1%, 0.05W, 0201, THICK FILM; Resistance: 2.2kR; Power Rating: 50mW; Tolerance: 1%; Voltage Rating: 25V; Temperature Coefficient: 200ppm/°C; Supplier 1: Farnell; Supplier Part Number 1: 1711624; Stock 1: 100; Pricing 1: 10=0,01730, 100=0,01040, 500=0,00740, 2500=0,00580, 7500=0,00470 (EUR); RoHS: Yes; Case/Package: SMD/SMT; Case Code (Metric): 0603; Case Code (Imperial): 0201; Min Operating Temperature: -55°C; Max Operating Temperature: 125°C; Packaging: Tape and Reel; Composition: Thick Film; Voltage Rating (DC): 25V; Width: 0.6mm; REACH SVHC: Yes; ComponentLink1URL: https://datasheet.ciiva.com/22689/1729044-22689526.pdf?src-supplier=Element14; ComponentLink1Description: https://datasheet.ciiva.com/22689/1729044-22689526.pdf?src-supplier=Element14
R23 = R0201: Manufacturer 1: Multicomp; Manufacturer Part Number 1: MCRE000123; VOLTAGE: 0V; Description: MULTICOMP   MCRE000123   Surface Mount Chip Resistor, Thick Film, MCRE Series, 200 ohm, 50 mW,  1%, 25 V; Tolerance: 1%; Temperature Coefficient: 200ppm/°C; Voltage Rating (DC): 25V; Power Rating: 50mW; Supplier 1: Farnell; Supplier Part Number 1: 1711596; Stock 1: 825; Pricing 1: 10=0,01730, 100=0,01040, 500=0,00740, 2500=0,00580, 7500=0,00470 (EUR); RoHS: Yes; Case/Package: SMD/SMT; Case Code (Metric): 0603; Case Code (Imperial): 0201; Min Operating Temperature: -55°C; Max Operating Temperature: 125°C; Packaging: Tape and Reel; Resistance: 200R; Composition: Thick Film; Voltage Rating: 25V; Width: 0.6mm; REACH SVHC: Yes; ComponentLink1URL: https://datasheet.ciiva.com/7695/1729044-7695515.pdf?src-supplier=Element14; ComponentLink1Description: https://datasheet.ciiva.com/7695/1729044-7695515.pdf?src-supplier=Element14; ComponentLink2URL: https://datasheet.ciiva.com/22686/1729044-22686952.pdf?src-supplier=Element14; ComponentLink2Description: https://datasheet.ciiva.com/22686/1729044-22686952.pdf?src-supplier=Element14; ComponentLink3URL: https://datasheet.ciiva.com/7695/1729044-7695516.pdf?src-supplier=Element14; ComponentLink3Description: https://datasheet.ciiva.com/7695/1729044-7695516.pdf?src-supplier=Element14
R24 = R0201: Manufacturer 1: Multicomp; Manufacturer Part Number 1: MCWR02X1001FAL; VOLTAGE: 1%; Description: MULTICOMP         MCWR02X1001FAL             SMD Chip Resistor, Thick Film, 1 kohm, 25 V, 0201 [0603 Metric], 50 mW,  1%, MCWR Series; Voltage Rating: 25V; Resistance: 1kR; Power Rating: 50mW; Temperature Coefficient: 100ppm/°C; Supplier 1: Farnell; Supplier Part Number 1: 2447064; Stock 1: 75000; Pricing 1: 15000=0,00230, 75000=0,00210, 150000=0,00190 (EUR); RoHS: No; Case/Package: 0201; Case Code (Metric): 0603; Case Code (Imperial): 0201; Packaging: Cut Tape; Composition: Thick Film; Tolerance: 1%; Voltage Rating (DC): 25V; REACH SVHC: No SVHC; ComponentLink1URL: http://www.farnell.com/datasheets/1849611.pdf?src-supplier=Element14; ComponentLink1Description: http://www.farnell.com/datasheets/1849611.pdf?src-supplier=Element14
R25 R26 = R0201: Manufacturer 1: Multicomp; Manufacturer Part Number 1: MCWR02X1003FAL; Description: MULTICOMP - MCWR02X1003FAL - RES, 100K, 1%, 0.05W, THICK FILM; Resistance: 100kR; Voltage Rating: 25V; Power Rating: 50mW; Temperature Coefficient: 100ppm/°C; Supplier 1: Farnell; Supplier Part Number 1: 2447751; Stock 1: 626; Pricing 1: 10=0,01110, 100=0,00670, 500=0,00470, 2500=0,00370, 7500=0,00300 (EUR); RoHS: No; Case/Package: 0201; Case Code (Metric): 0603; Case Code (Imperial): 0201; Packaging: Cut Tape; Composition: Thick Film; Tolerance: 1%; Voltage Rating (DC): 25V; REACH SVHC: No SVHC; ComponentLink1URL: http://www.farnell.com/datasheets/2360050.pdf?src-supplier=Farnell; ComponentLink1Description: http://www.farnell.com/datasheets/2360050.pdf?src-supplier=Farnell; ComponentLink2URL: http://www.farnell.com/datasheets/1849611.pdf?src-supplier=Element14; ComponentLink2Description: http://www.farnell.com/datasheets/1849611.pdf?src-supplier=Element14
U2 = MCIMX7S3DVK08SD: Supplier 1: Mouser; Supplier Part Number 1: 771-MCIMX7S3DVK08SD